# Altium project VirtualWire_BreadBoard.PrjPcb
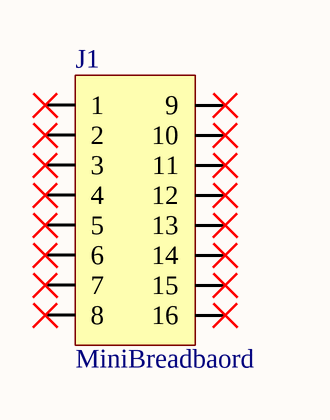
[diagram p0: VirtualWire_BreadBoard.SchDoc]
1 sheet, 1 parts. Net scope: global (net labels, ports and power ports of the same name join across sheets).
Board file: VirtualWire_BreadBoard.PcbDoc

## Sheet VirtualWire_BreadBoard.SchDoc
size A

### Parts
J1  MiniBreadbaord  [MINI_BREADBOARD HOLE]

### Nets

Not connected (* = marked no-connect by the designer): J1 1* 2* 3* 4* 5* 6* 7* 8* 9* 10* 11* 12* 13* 14* 15* 16*

### Library data of the parts
J1 = MINI_BREADBOARD_16: Mini Breadboard; Manufacturer: TE Connectivity AMP; Manufacturer Part Number: 1738132-1; Gender: Male; Supplier 1: Digi-Key; Stock 1: 0; Colour: Natural; ComponentLink1URL: http://www.te.com/commerce/DocumentDelivery/DDEController?Action=srchrtrv&DocNm=1738132&DocType=Customer+Drawing&DocLang=English; ComponentLink1Description: http://www.te.com/commerce/DocumentDelivery/DDEController?Action=srchrtrv&DocNm=1738132&DocType=Customer+Drawing&DocLang=English; Supplier Part Number 1: 1738132-1-ND